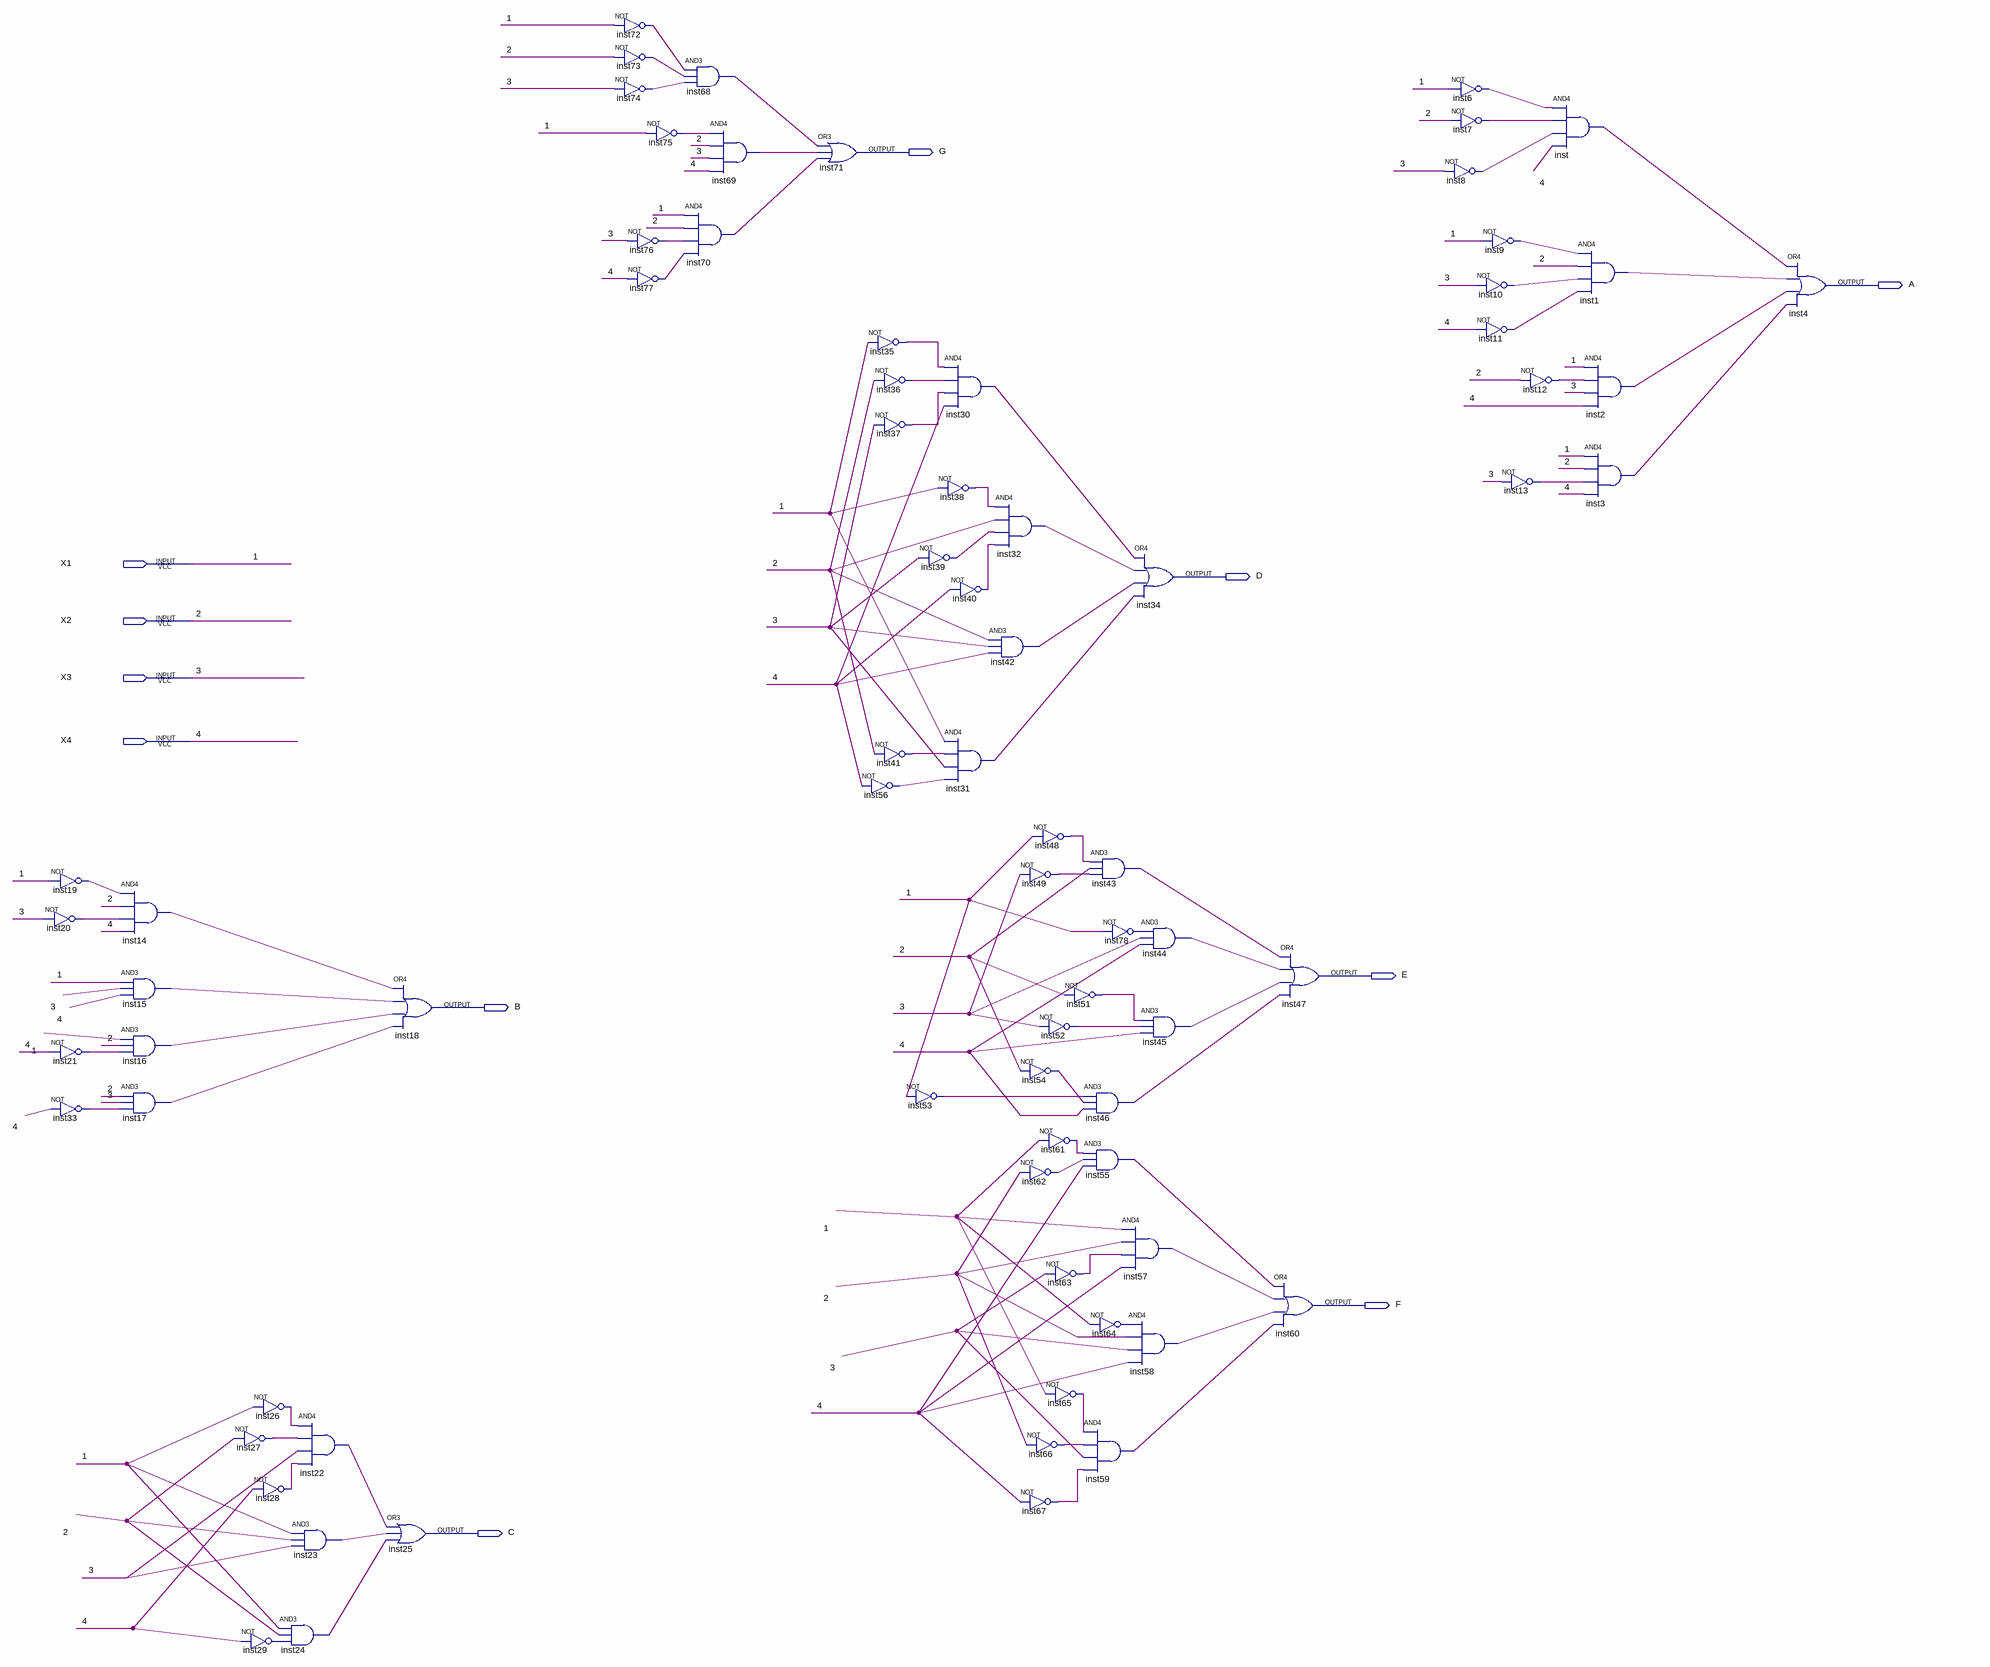
[diagram p0: schematic sheet]
// Quartus schematic aula04.bdf as structural Verilog: 77 symbols, 11 pins
module aula04 (
  input  X1,
  input  X2,
  input  X3,
  input  X4,
  output G,
  output A,
  output D,
  output E,
  output B,
  output F,
  output C
);

  wire inst1_out, inst2_out, inst3_out, inst6_out, inst7_out, inst8_out, inst9_out, inst10_out, inst11_out,
       inst12_out, inst13_out, inst14_out, inst15_out, inst16_out, inst17_out, inst19_out, inst20_out,
       inst21_out, inst22_out, inst23_out, inst24_out, inst26_out, inst27_out, inst28_out, inst29_out,
       inst30_out, inst31_out, inst32_out, inst33_out, inst35_out, inst36_out, inst37_out, inst38_out,
       inst39_out, inst40_out, inst41_out, inst42_out, inst43_out, inst44_out, inst45_out, inst46_out,
       inst48_out, inst49_out, inst51_out, inst52_out, inst53_out, inst54_out, inst55_out, inst56_out,
       inst57_out, inst58_out, inst59_out, inst61_out, inst62_out, inst63_out, inst64_out, inst65_out,
       inst66_out, inst67_out, inst68_out, inst69_out, inst70_out, inst72_out, inst73_out, inst74_out,
       inst75_out, inst76_out, inst77_out, inst78_out, inst_out;

  not inst19 (inst19_out, X1);
  not inst20 (inst20_out, X3);
  not inst21 (inst21_out, X4);
  not inst33 (inst33_out, X4);
  and inst14 (inst14_out, inst19_out, X2, inst20_out, X4);
  and inst15 (inst15_out, X1, X3, X4);
  and inst16 (inst16_out, X1, X2, inst21_out);
  and inst17 (inst17_out, X2, X3, inst33_out);
  not inst26 (inst26_out, X1);
  not inst27 (inst27_out, X2);
  not inst28 (inst28_out, X4);
  not inst29 (inst29_out, X4);
  and inst22 (inst22_out, inst26_out, inst27_out, X3, inst28_out);
  and inst23 (inst23_out, X1, X2, X3);
  and inst24 (inst24_out, X1, X2, inst29_out);
  or inst18 (B, inst14_out, inst15_out, inst16_out, inst17_out);
  or inst25 (C, inst22_out, inst23_out, inst24_out);
  not inst72 (inst72_out, X1);
  not inst73 (inst73_out, X2);
  not inst74 (inst74_out, X3);
  not inst75 (inst75_out, X1);
  not inst76 (inst76_out, X3);
  not inst77 (inst77_out, X4);
  and inst68 (inst68_out, inst72_out, inst73_out, inst74_out);
  and inst69 (inst69_out, inst75_out, X2, X3, X4);
  and inst70 (inst70_out, X1, X2, inst76_out, inst77_out);
  or inst71 (G, inst68_out, inst69_out, inst70_out);
  not inst56 (inst56_out, X4);
  not inst35 (inst35_out, X1);
  not inst36 (inst36_out, X2);
  not inst37 (inst37_out, X3);
  not inst41 (inst41_out, X2);
  not inst53 (inst53_out, X1);
  and inst30 (inst30_out, inst35_out, inst36_out, inst37_out, X4);
  not inst38 (inst38_out, X1);
  not inst39 (inst39_out, X3);
  not inst40 (inst40_out, X4);
  and inst31 (inst31_out, X1, inst41_out, X3, inst56_out);
  and inst32 (inst32_out, inst38_out, X2, inst39_out, inst40_out);
  and inst42 (inst42_out, X2, X3, X4);
  not inst48 (inst48_out, X1);
  not inst49 (inst49_out, X3);
  not inst51 (inst51_out, X2);
  not inst52 (inst52_out, X3);
  not inst54 (inst54_out, X2);
  not inst61 (inst61_out, X1);
  not inst62 (inst62_out, X2);
  not inst63 (inst63_out, X3);
  not inst65 (inst65_out, X1);
  not inst66 (inst66_out, X2);
  not inst67 (inst67_out, X4);
  and inst43 (inst43_out, inst48_out, X2, inst49_out);
  not inst78 (inst78_out, X1);
  and inst46 (inst46_out, inst53_out, inst54_out, X4);
  and inst55 (inst55_out, inst61_out, inst62_out, X4);
  not inst64 (inst64_out, X1);
  and inst59 (inst59_out, inst65_out, inst66_out, X3, inst67_out);
  or inst34 (D, inst30_out, inst32_out, inst42_out, inst31_out);
  and inst44 (inst44_out, inst78_out, X3, X4);
  and inst45 (inst45_out, inst51_out, inst52_out, X4);
  and inst57 (inst57_out, X1, X2, inst63_out, X4);
  and inst58 (inst58_out, inst64_out, X2, X3, X4);
  or inst47 (E, inst43_out, inst44_out, inst45_out, inst46_out);
  or inst60 (F, inst55_out, inst57_out, inst58_out, inst59_out);
  not inst6 (inst6_out, X1);
  not inst7 (inst7_out, X2);
  not inst8 (inst8_out, X3);
  not inst9 (inst9_out, X1);
  not inst10 (inst10_out, X3);
  not inst11 (inst11_out, X4);
  not inst12 (inst12_out, X2);
  not inst13 (inst13_out, X3);
  and inst (inst_out, inst6_out, inst7_out, inst8_out, X4);
  and inst1 (inst1_out, inst9_out, X2, inst10_out, inst11_out);
  and inst2 (inst2_out, X1, inst12_out, X3, X4);
  and inst3 (inst3_out, X1, X2, inst13_out, X4);
  or inst4 (A, inst_out, inst1_out, inst2_out, inst3_out);

  // Other names for the same wires on the sheet: 1 = X1; 2 = X2; 3 = X3; 4 = X4
endmodule
